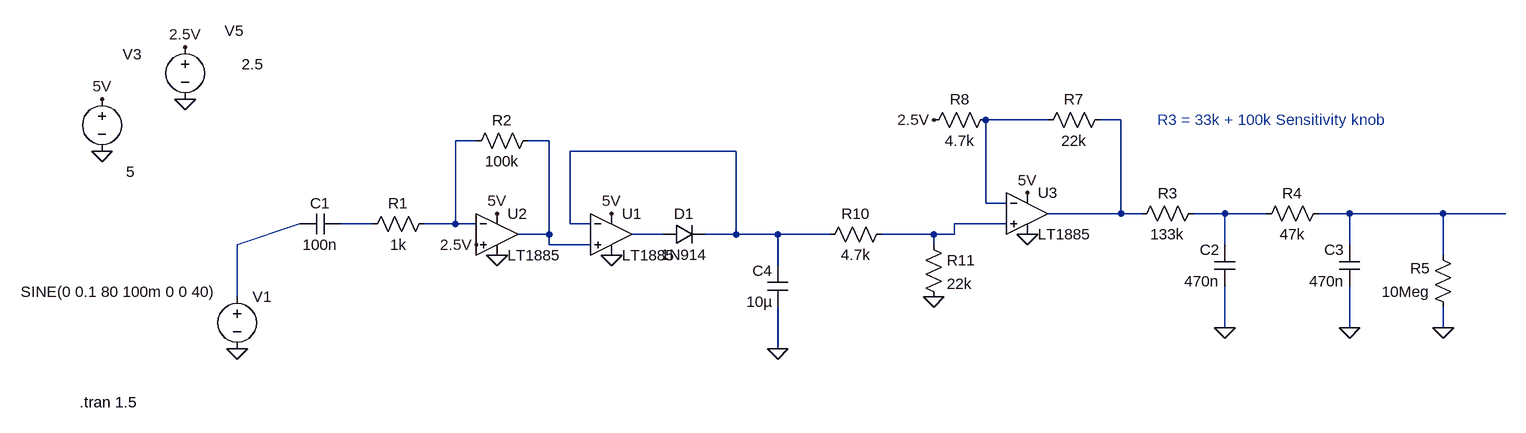
[diagram p0: schematic EnvelopeDetector.asc]
EnvelopeDetector.asc, the LTspice schematic file:
Version 4
SHEET 1 2052 680
WIRE 1344 -128 1248 -128
WIRE 1456 -128 1424 -128
WIRE 464 -96 432 -96
WIRE 576 -96 544 -96
WIRE 864 -80 608 -80
WIRE 1248 0 1248 -128
WIRE 1280 0 1248 0
WIRE 1456 16 1456 -128
WIRE 1456 16 1344 16
WIRE 1488 16 1456 16
WIRE 1616 16 1568 16
WIRE 1680 16 1616 16
WIRE 1808 16 1760 16
WIRE 1952 16 1808 16
WIRE 2048 16 1952 16
WIRE 304 32 256 32
WIRE 432 32 432 -96
WIRE 432 32 384 32
WIRE 464 32 432 32
WIRE 608 32 608 -80
WIRE 640 32 608 32
WIRE 1280 32 1200 32
WIRE 576 48 576 -96
WIRE 576 48 528 48
WIRE 752 48 704 48
WIRE 864 48 864 -80
WIRE 864 48 816 48
WIRE 928 48 864 48
WIRE 1008 48 928 48
WIRE 1168 48 1088 48
WIRE 1200 48 1200 32
WIRE 1200 48 1168 48
WIRE 96 64 192 32
WIRE 576 64 576 48
WIRE 640 64 576 64
WIRE 1168 64 1168 48
WIRE 1616 64 1616 16
WIRE 1808 64 1808 16
WIRE 1952 80 1952 16
WIRE 928 96 928 48
WIRE 96 144 96 64
WIRE 1616 192 1616 128
WIRE 1808 192 1808 128
WIRE 1952 192 1952 160
WIRE 928 224 928 160
FLAG 96 224 0
FLAG -112 -80 0
FLAG 16 -160 0
FLAG 16 -240 2.5V
FLAG 496 80 0
FLAG 1952 192 0
FLAG 1312 48 0
FLAG 928 224 0
FLAG 672 80 0
FLAG -112 -160 5V
FLAG 496 16 5V
FLAG 672 16 5V
FLAG 1312 -16 5V
FLAG 1168 -128 2.5V
FLAG 464 64 2.5V
FLAG 1168 144 0
FLAG 1616 192 0
FLAG 1808 192 0
SYMBOL voltage 96 128 R0
WINDOW 3 -333 8 Left 2
WINDOW 123 0 0 Left 2
WINDOW 39 0 0 Left 2
SYMATTR InstName V1
SYMATTR Value SINE(0 0.1 80 100m 0 0 40)
SYMBOL voltage -112 -176 R0
WINDOW 0 32 -53 Left 2
WINDOW 3 37 128 Left 2
WINDOW 123 0 0 Left 2
WINDOW 39 0 0 Left 2
SYMATTR InstName V3
SYMATTR Value 5
SYMBOL voltage 16 -256 R0
WINDOW 0 61 -9 Left 2
WINDOW 3 87 42 Left 2
WINDOW 123 0 0 Left 2
WINDOW 39 0 0 Left 2
SYMATTR InstName V5
SYMATTR Value 2.5
SYMBOL cap 256 16 R90
WINDOW 0 0 32 VBottom 2
WINDOW 3 32 32 VTop 2
SYMATTR InstName C1
SYMATTR Value 100n
SYMBOL res 560 -112 R90
WINDOW 0 0 56 VBottom 2
WINDOW 3 32 56 VTop 2
SYMATTR InstName R2
SYMATTR Value 100k
SYMBOL res 1968 176 R180
WINDOW 0 36 76 Left 2
WINDOW 3 36 40 Left 2
SYMATTR InstName R5
SYMATTR Value 10Meg
SYMBOL diode 752 64 R270
WINDOW 0 32 32 VTop 2
WINDOW 3 0 32 VBottom 2
SYMATTR InstName D1
SYMATTR Value 1N914
SYMBOL res 1328 -112 R270
WINDOW 0 32 56 VTop 2
WINDOW 3 0 56 VBottom 2
SYMATTR InstName R7
SYMATTR Value 22k
SYMBOL res 1152 -112 R270
WINDOW 0 32 56 VTop 2
WINDOW 3 0 56 VBottom 2
SYMATTR InstName R8
SYMATTR Value 4.7k
SYMBOL res 1104 32 R90
WINDOW 0 0 56 VBottom 2
WINDOW 3 32 56 VTop 2
SYMATTR InstName R10
SYMATTR Value 4.7k
SYMBOL res 1152 48 R0
SYMATTR InstName R11
SYMATTR Value 22k
SYMBOL cap 944 160 R180
WINDOW 0 24 56 Left 2
WINDOW 3 24 8 Left 2
SYMATTR InstName C4
SYMATTR Value 10µ
SYMBOL res 400 16 R90
WINDOW 0 0 56 VBottom 2
WINDOW 3 32 56 VTop 2
SYMATTR InstName R1
SYMATTR Value 1k
SYMBOL Opamps\\LT1885 672 48 R0
SYMATTR InstName U1
SYMBOL Opamps\\LT1885 496 48 R0
SYMATTR InstName U2
SYMBOL Opamps\\LT1885 1312 16 R0
SYMATTR InstName U3
SYMBOL cap 1632 128 R180
WINDOW 0 24 56 Left 2
WINDOW 3 24 8 Left 2
SYMATTR InstName C2
SYMATTR Value 470n
SYMBOL res 1472 32 R270
WINDOW 0 32 56 VTop 2
WINDOW 3 0 56 VBottom 2
SYMATTR InstName R3
SYMATTR Value 133k
SYMBOL cap 1824 128 R180
WINDOW 0 24 56 Left 2
WINDOW 3 24 8 Left 2
SYMATTR InstName C3
SYMATTR Value 470n
SYMBOL res 1664 32 R270
WINDOW 0 32 56 VTop 2
WINDOW 3 0 56 VBottom 2
SYMATTR InstName R4
SYMATTR Value 47k
TEXT -146 306 Left 2 !.tran 1.5
TEXT 1512 -128 Left 2 ;R3 = 33k + 100k Sensitivity knob

The netlist it stands for:
* EnvelopeDetector.asc
V1 N011 0 SINE(0 0.1 80 100m 0 0 40)
V3 5V 0 5
V5 2.5V 0 2.5
C1 N008 N011 100n
R2 N004 N003 100k
R5 0 N007 10Meg
D1 N010 N005 1N914
R7 N001 N002 22k
R8 2.5V N001 4.7k
R10 N009 N005 4.7k
R11 N009 0 22k
C4 0 N005 10µ
R1 N003 N008 1k
* U1: LT1885 (symbol Opamps\LT1885 not available, pins judged from their places): In+=N004 In-=N005 V+=5V V-=0 OUT=N010
* U2: LT1885 (symbol Opamps\LT1885 not available, pins judged from their places): In+=2.5V In-=N003 V+=5V V-=0 OUT=N004
* U3: LT1885 (symbol Opamps\LT1885 not available, pins judged from their places): In+=N009 In-=N001 V+=5V V-=0 OUT=N002
C2 0 N006 470n
R3 N002 N006 133k
C3 0 N007 470n
R4 N006 N007 47k
.model D D
.lib standard.dio
.tran 1.5
* R3 = 33k + 100k Sensitivity knob
.backanno
.end